# Altium schematic sheet Rear_Servo_Supply.SchDoc
size A4; SheetNumber: 9; SheetTotal: 18
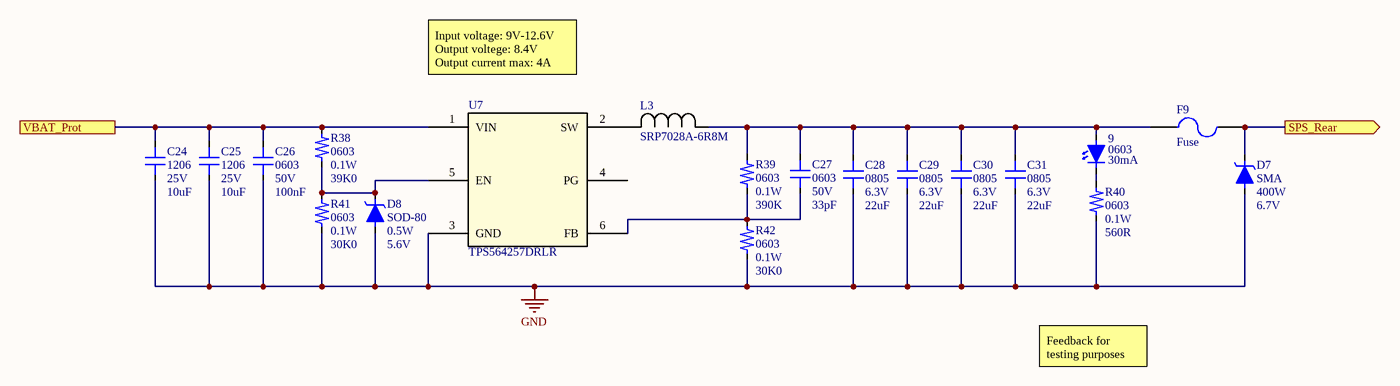
[diagram p0: Rear_Servo_Supply.SchDoc]

## Parts
9  0603  Rating: 30mA  [LED_0603]
C24  1206  value 10uF  Rating: 25V  [C_1206]
C25  1206  value 10uF  Rating: 25V  [C_1206]
C26  0603  value 100nF  Rating: 50V  [C_0603]
C27  0603  value 33pF  Rating: 50V  [C_0603]
C28  0805  value 22uF  Rating: 6.3V  [C_0805]
C29  0805  value 22uF  Rating: 6.3V  [C_0805]
C30  0805  value 22uF  Rating: 6.3V  [C_0805]
C31  0805  value 22uF  Rating: 6.3V  [C_0805]
D7  SMA  value 6.7V  Rating: 400W  [SMA]
D8  SOD-80  value 5.6V  Rating: 0.5W  [SOD-80]
F9  Fuse  [F_2410]
L3  SRP7028A-6R8M  [IND_SRP7028A-6R8M_BRN]
R38  0603  value 39K0  Rating: 0.1W  [R_0603]
R39  0603  value 390K  Rating: 0.1W  [R_0603]
R40  0603  value 560R  Rating: 0.1W  [R_0603]
R41  0603  value 30K0  Rating: 0.1W  [R_0603]
R42  0603  value 30K0  Rating: 0.1W  [R_0603]
U7  TPS564257DRLR  [TPS564242DRLR_TEX]

## Ports
SPS_Rear (out), VBAT_Prot

## Nets
GND: C24.1(C1) C25.1(C1) C26.1(C1) C28.1(C1) C29.1(C1) C30.1(C1) C31.1(C1) D7.2(DA) D8.2(DA) R40.1(R1) R41.1(R1) R42.1(R1) U7.3(GND)
SPS_Rear: D7.1(DC) F9.2 ; port SPS_Rear
VBAT_Prot: C24.2(C2) C25.2(C2) C26.2(C2) R38.2(R2) U7.1(VIN) ; port VBAT_Prot
Net9_1: 9.1(DC) R40.2(R2)
Net9_2: 9.2(DA) C27.2(C2) C28.2(C2) C29.2(C2) C30.2(C2) C31.2(C2) F9.1 L3.1 R39.2(R2)
NetC27_1: C27.1(C1) R39.1(R1) R42.2(R2) U7.6(FB)
NetD8_1: D8.1(DC) R38.1(R1) R41.2(R2) U7.5(EN)
NetL3_2: L3.2 U7.2(SW)

Not connected (* = marked no-connect by the designer): U7 4(PG)

## Notes on the sheet
- Input voltage: 9V-12.6V
  Output voltege: 8.4V
  Output current max: 4A
- Feedback for testing purposes

## Library data of the parts
9 = Opt_FYLS-0603UGC_LED_0603_Green_30mA_Diode_LED: Note: 40mcd; Tolerance: 5%; Distributor: Lomex; Link: http://lomex.hu/hu/webshop/#/page,0/stype,1/sidx,10/instock,0/search,95-03-08; Order Number: 95-03-08; Package: 0603; Part Number: FYLS-0603UGC; Price (HUF): 10; Type: LED; ID: Opt_FYLS-0603UGC_LED_0603_Green_30mA_Diode_LED
C24 C25 = C3216X7R1E106K160AB: Type: Chip Capacitor; Tolerance: 10%; Order Number: 2522133; ID: Cap_1206_10uF_25V_Chip; Part Number: C3216X7R1E106K160AB; Distributor: Farnell; Link: http://hu.farnell.com/tdk/c3216x7r1e106k160ab/capacitor-mlcc-x7r-10uf-25v-1206/dp/2522133; Price (HUF): 109; Package: 1206; NI Part Number: -; NI PEN/DEB: -
C26 = CC0603KRX7R9BB104: NI Part Number: 716340-01; Type: Chip Capacitor; Tolerance: 10%; ID: Cap_0603_100nF_50V_Chip; NI PEN/DEB: DEB; Part Number: CC0603KRX7R9BB104; Order Number: 82-06-23; Distributor: Lomex; Link: http://lomex.hu/hu/webshop/#/page,0/search,82-06-23/stype,1/sidx,1; Price (HUF): 2.00; Package: 0603
C27 = CL10C330JB8NNNC: NI Part Number: 715511-01; Type: Chip Capacitor; Tolerance: 5%; ID: Cap_0603_33pF_50V_Chip; NI PEN/DEB: DEB; Part Number: CL10C330JB8NNNC; Order Number: 82-09-74; Distributor: Lomex; Link: http://lomex.hu/hu/webshop/#/page,0/search,82-09-74/stype,1/sidx,1; Price (HUF): 2.00; Package: 0603
C28-C31 = CL21A226MQQNNNG: Type: Chip Capacitor; Tolerance: 20%; ID: Cap_0805_22uF_6.3V_Chip; Part Number: CL21A226MQQNNNG; Order Number: 82-08-19; Distributor: Lomex; Link: http://lomex.hu/hu/webshop/#/page,0/search,82-08-19/stype,1/sidx,1; Price (HUF): 2.00; Package: 0805; NI Part Number: -; NI PEN/DEB: -
D7 = SMAJ5.0A: Tolerance: 5%; Type: Transient Voltage Suppressor; ID: Dio_SMA_6.7V_400W_Transient_Sup; Distributor: Lomex; Link: http://lomex.hu/hu/webshop/#/search,96-00-75/stype,1; Order Number: 96-00-75; Package: SMA; Part Number: SMAJ5.0A; Price (HUF): 20; NI part number: -; NI PEN/DEB: -
D8 = BZV55C5V6: Type: Zener Diode; ID: Dio_SOD-80_5.6V_0.5W_Zener; Distributor: Lomex; Link: http://lomex.hu/hu/webshop/#/page,0/search,85-01-72/stype,1/sidx,1; Order Number: 85-01-72; Package: SOD-80; Part Number: BZV55C5V6; Price (HUF): 5; NI part number: -; NI PEN/DEB: -
F9 = 0451003.MRL: ID: Oth_0451003.MRL_F_2410; Rating: 125V; Type: Very Fast Acting Fuse; Value: 3A; Distributor: Lomex; Link: http://lomex.hu/hu/webshop/#page,0/search,44-02-68/stype,1; Order number: 44-02-68; Package: F_2410; Part Number: 0451003.MRL; Price (HUF): 33; NI part number: -; NI PEN/DEB: -
L3 = SRP7028A-6R8M: No Description Available; Mfr_Name: Bourns Electronics; Type: DEV; Copyright: Copyright (C) 2023 Ultra Librarian. All rights reserved.; Manufacturer_Part_Number: SRP7028A-6R8M; RefDes: RefDes
R38 = CR-03JL7---39K: NI part number: 613245-01; Tolerance: 5%; ID: Res_0603_39K0_0.1W_Chip; NI PEN/DEB: DEB; Type: Chip Resistor; Part Number: CR-03JL7---39K; Order Number: 81-10-45; Distributor: Lomex; Link: http://lomex.hu/hu/webshop/#/page,0/search,81-10-45/stype,1/sidx,1; Price (HUF): 0.80; Package: 0603
R39 = CR-03FL7--390K: Tolerance: 1%; ID: Res_0603_390K_0.1W_Chip; Type: Chip Resistor; Part Number: CR-03FL7--390K; Order Number: 80-13-26; Distributor: Lomex; Link: http://lomex.hu/hu/webshop/#/page,0/search,80-13-26/stype,1/sidx,1; Price (HUF): 0.80; Package: 0603; NI part number: -; NI PEN/DEB: -
R40 = CR-03FL7--560R: NI part number: 612556-01; Tolerance: 1%; Note: NI: not in stock; ID: Res_0603_560R_0.1W_Chip; NI PEN/DEB: DEB; Type: Chip Resistor; Part Number: CR-03FL7--560R; Order Number: 80-14-41; Distributor: Lomex; Link: http://lomex.hu/hu/webshop/#/page,0/search,80-14-41/stype,1/sidx,1; Price (HUF): 0.80; Package: 0603
R41 R42 = CR-03FL7---30K: NI part number: 612699-01; Tolerance: 1%; Note: NI: not in stock; ID: Res_0603_30K0_0.1W_Chip; NI PEN/DEB: DEB; Type: Chip Resistor; Part Number: CR-03FL7---30K; Order Number: 80-14-53; Distributor: Lomex; Link: http://lomex.hu/hu/webshop/#/page,0/search,80-14-53/stype,1/sidx,1; Price (HUF): 0.80; Package: 0603
U7 = TPS564257DRLR: No Description Available; Mfr_Name: Texas Instruments; Type: DEV; Copyright: Copyright (C) 2023 Ultra Librarian. All rights reserved.; Manufacturer_Part_Number: TPS564257DRLR; RefDes: RefDes